# Altium project Stepper_Ctrl.PrjPcb
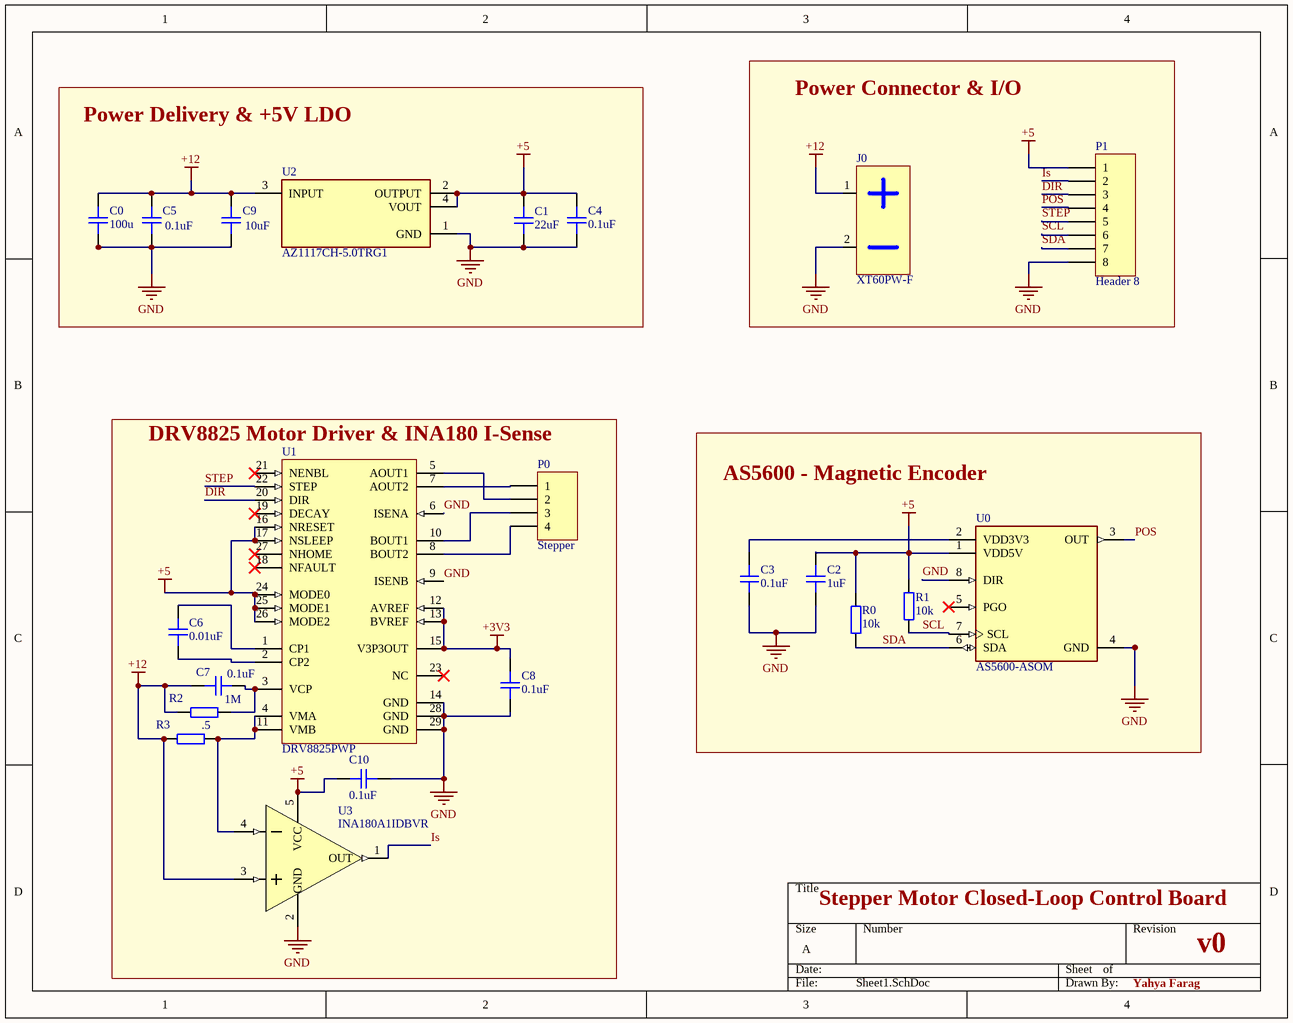
[diagram p0: Sheet1.SchDoc]
1 sheet, 22 parts. Net scope: global (net labels, ports and power ports of the same name join across sheets).
Board file: PCB2.PcbDoc

## Sheet Sheet1.SchDoc
size A; SheetNumber: 1; SheetTotal: 1

### Parts
C0  100u  [CAP-EL-NP-5MM]
C1  22uF  [CAP_0805]
C2  1uF  [CAP_0805]
C3  0.1uF  [CAP_0805]
C4  0.1uF  [CAP_0805]
C5  0.1uF  [CAP_0805]
C6  0.01uF  [CAP_0805]
C7  0.1uF  [CAP_0805]
C8  0.1uF  [CAP_0805]
C9  10uF  [CAP_0805]
C10  0.1uF  [CAP_0805]
J0  XT60PW-F  [XT60PW-F]
P0  Stepper  [HDR1X4]
P1  Header 8  [HDR1X8]
R0  10k  [RES_0805]
R1  10k  [RES_0805]
R2  1M  [RES_0805]
R3  .5  [RES_0805]
U0  AS5600-ASOM  [FP-AS5600-ASOM-IPC_C]
U1  DRV8825PWP  [PWP0028C_L]
U2  AZ1117CH-5.0TRG1  [FP-SOT223-MFG]
U3  INA180A1IDBVR  [SOT-23-5]

### Blocks framed on the sheet
Power Connector & I/O: J0 P1
Power Delivery & +5V LDO: C0 C1 C4 C5 C9 U2
DRV8825 Motor Driver & INA180 I-Sense: C6-C8 C10 P0 R2 R3 U1 U3
AS5600 - Magnetic Encoder: C2 C3 R0 R1 U0

### Nets
+3V3: C8.1 U1.12(AVREF) U1.13(BVREF) U1.15(V3P3OUT)
+5: C1.1 C2.1 C4.1 C10.1 P1.1 R0.1 R1.1 U0.1(VDD5V) U1.16(NRESET) U1.17(NSLEEP) U1.24(MODE0) U1.25(MODE1) U1.26(MODE2) U2.2(OUTPUT) U2.4(VOUT) U3.5(VCC)
+12: C0.1 C5.1 C7.2 C9.1 J0.1(V+) R2.2 R3.2 U2.3(INPUT) U3.3
GND: C0.2 C1.2 C2.2 C3.2 C4.2 C5.2 C8.2 C9.2 C10.2 J0.2(V-) P1.8 U0.4(GND) U0.8(DIR) U1.6(ISENA) U1.9(ISENB) U1.14(GND) U1.28(GND) U1.29(GND) U2.1(GND) U3.2(GND)
DIR: P1.3 U1.20(DIR)
Is: P1.2 U3.1(OUT)
POS: P1.4 U0.3(OUT)
SCL: P1.6 R1.2 U0.7(SCL)
SDA: P1.7 R0.2 U0.6(SDA)
STEP: P1.5 U1.22(STEP)
NetC3_1: C3.1 U0.2(VDD3V3)
NetC6_1: C6.1 U1.1(CP1)
NetC6_2: C6.2 U1.2(CP2)
NetC7_1: C7.1 R2.1 U1.3(VCP)
NetP0_1: P0.1 U1.7(AOUT2)
NetP0_2: P0.2 U1.5(AOUT1)
NetP0_3: P0.3 U1.10(BOUT1)
NetP0_4: P0.4 U1.8(BOUT2)
NetR3_1: R3.1 U1.4(VMA) U1.11(VMB) U3.4

Not connected (* = marked no-connect by the designer): U0 5(PGO)*; U1 18(NFAULT)* 19(DECAY)* 21(NENBL)* 23(NC)* 27(NHOME)*

### Notes on the sheet
- Stepper Motor Closed-Loop Control Board
- v0
- Yahya Farag

### Library data of the parts
C0 = CAP_EL_NP_5MM: Capacitor SMD Electrolytic Non-Polarised 5mm Diameter - 12V; Manufacturer: Nichicon; Manufacturer Part Number: *
C1-C4 C8 C10 = CAP_0805_6V3: Capacitor SMD 0805 6V3
C5 C9 = CAP_0805_6V3: Capacitor SMD 0805 12V
C6 = CAP_0805_6V3: Capacitor SMD 0805 50V
C7 = CAP_0805_6V3: Capacitor SMD 0805 16V
J0 = XT60PW-F: XT60 horizontal female 2-pin AMASS; Manufacturer: AMASS; Manufacturer Part Number: XT60PW-F; Distributor Link: https://www.tme.eu/de/details/xt60pw-f/dc-steckverbinder/amass/
P0 = Header 4: Header, 4-Pin; LatestRevisionDate: 17-Jul-2002; LatestRevisionNote: Re-released for DXP Platform.; Publisher: Altium Limited
P1 = Header 8: Header, 8-Pin; LatestRevisionDate: 17-Jul-2002; LatestRevisionNote: Re-released for DXP Platform.; Publisher: Altium Limited
R0-R3 = RES_0805: Resistor SMD 0805; Manufacturer: *; Manufacturer Part Number: *; Distributor Link: *
U0 = CMP-22826-000002-1: SENSOR ANGLE 360DEG SMD; Sensing Method: Hall Effect; Termination: SMD/SMT; Min Operating Temperature: -40°C; Mount: Surface Mount; Lead Free: Lead Free; Max Operating Temperature: 125°C
U1 = CMP-1685-00019-1: Stepper Motor Controller IC, 8.2 to 45 V, -40 to 85 degC, 28-Pin HTSSOP (PWP), Green (RoHS & no Sb/Br), Tube; Voltage Rating: 100 V; Tolerance: 20%; Capacitance: 47 uF; Case\Package: Radial; ComponentLink2URL: http://www.ti.com/general/docs/lit/getliterature.tsp?genericPartNumber=DRV8825&fileType=pdf; Voltage Rating (DC): 100 V; Lead Pitch: 3.5 mm; Diameter: 8 mm; DatasheetVersion: SLVSA73F, 07/2014; ComponentLink2Description: Datasheet; Package Quantity: 200; PackageDescription: 28-Pin Small Outline Package Integrated Circuit, Body 9.7 x 4.4 mm, Pitch 0.65 mm; Packaging: Bulk; Pins: 2; Min Operating Temperature: -40 degC; Width: 8 mm; ComponentLink1Description: Manufacturer URL; Length: 11.5 mm; Max Operating Temperature: 85 degC; Height: 11.5 mm; REACH SVHC: No SVHC; Mount: Through Hole; PackageReference: PWP0028C; RoHSCompliant: true; Radiation Hardening: No; ComponentLink1URL: http://www.ti.com/
U2 = CMP-12756-000028-1: IC REG LINEAR 3.3V 800MA SOT223; Accuracy: 1%; Reference Voltage: 1.262V; Quiescent Current: 6mA; Power Supply Rejection Ratio (PSRR): 70dB; Max Input Voltage: 15V; Max Output Current: 1.35A; Output Type: Fixed; Min Current Limit: 1A; Number of Regulators: 1; Polarity: Positive; Dropout Voltage: 1.2V; Output Current: 800mA; Width: 3.7mm; Case/Package: SOT-223; Length: 6.7mm; Mount: Surface Mount; Output Voltage: 3.3V; Lead Free: Lead Free; Min Operating Temperature: -20°C; Packaging: Tape and Reel; Package Quantity: 4000; Max Operating Temperature: 125°C; Number of Pins: 4; Number of Outputs: 1; Height: 1.7mm